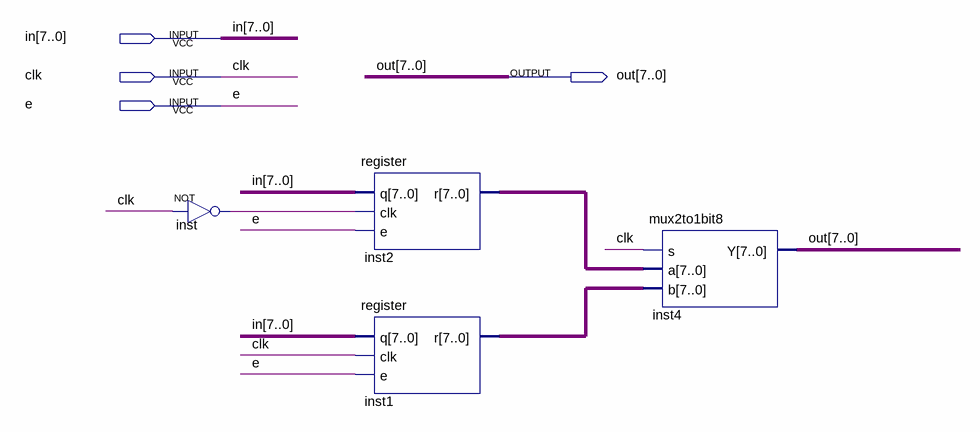
[diagram p0: schematic sheet]
// Quartus schematic pc2edges.bdf as structural Verilog: 4 symbols, 4 pins
module pc2edges (
  input  [7:0] in,
  input  clk,
  input  e,
  output [7:0] out
);

  wire inst_out;
  wire [7:0] inst1_r, inst2_r;

  not inst (inst_out, clk);
  register inst2 (.q(in), .clk(inst_out), .e(e), .r(inst2_r));
  register inst1 (.q(in), .clk(clk), .e(e), .r(inst1_r));
  mux2to1bit8 inst4 (.s(clk), .a(inst2_r), .b(inst1_r), .Y(out));
endmodule
